# EAGLE design W051X (EAGLE 6.6.0)
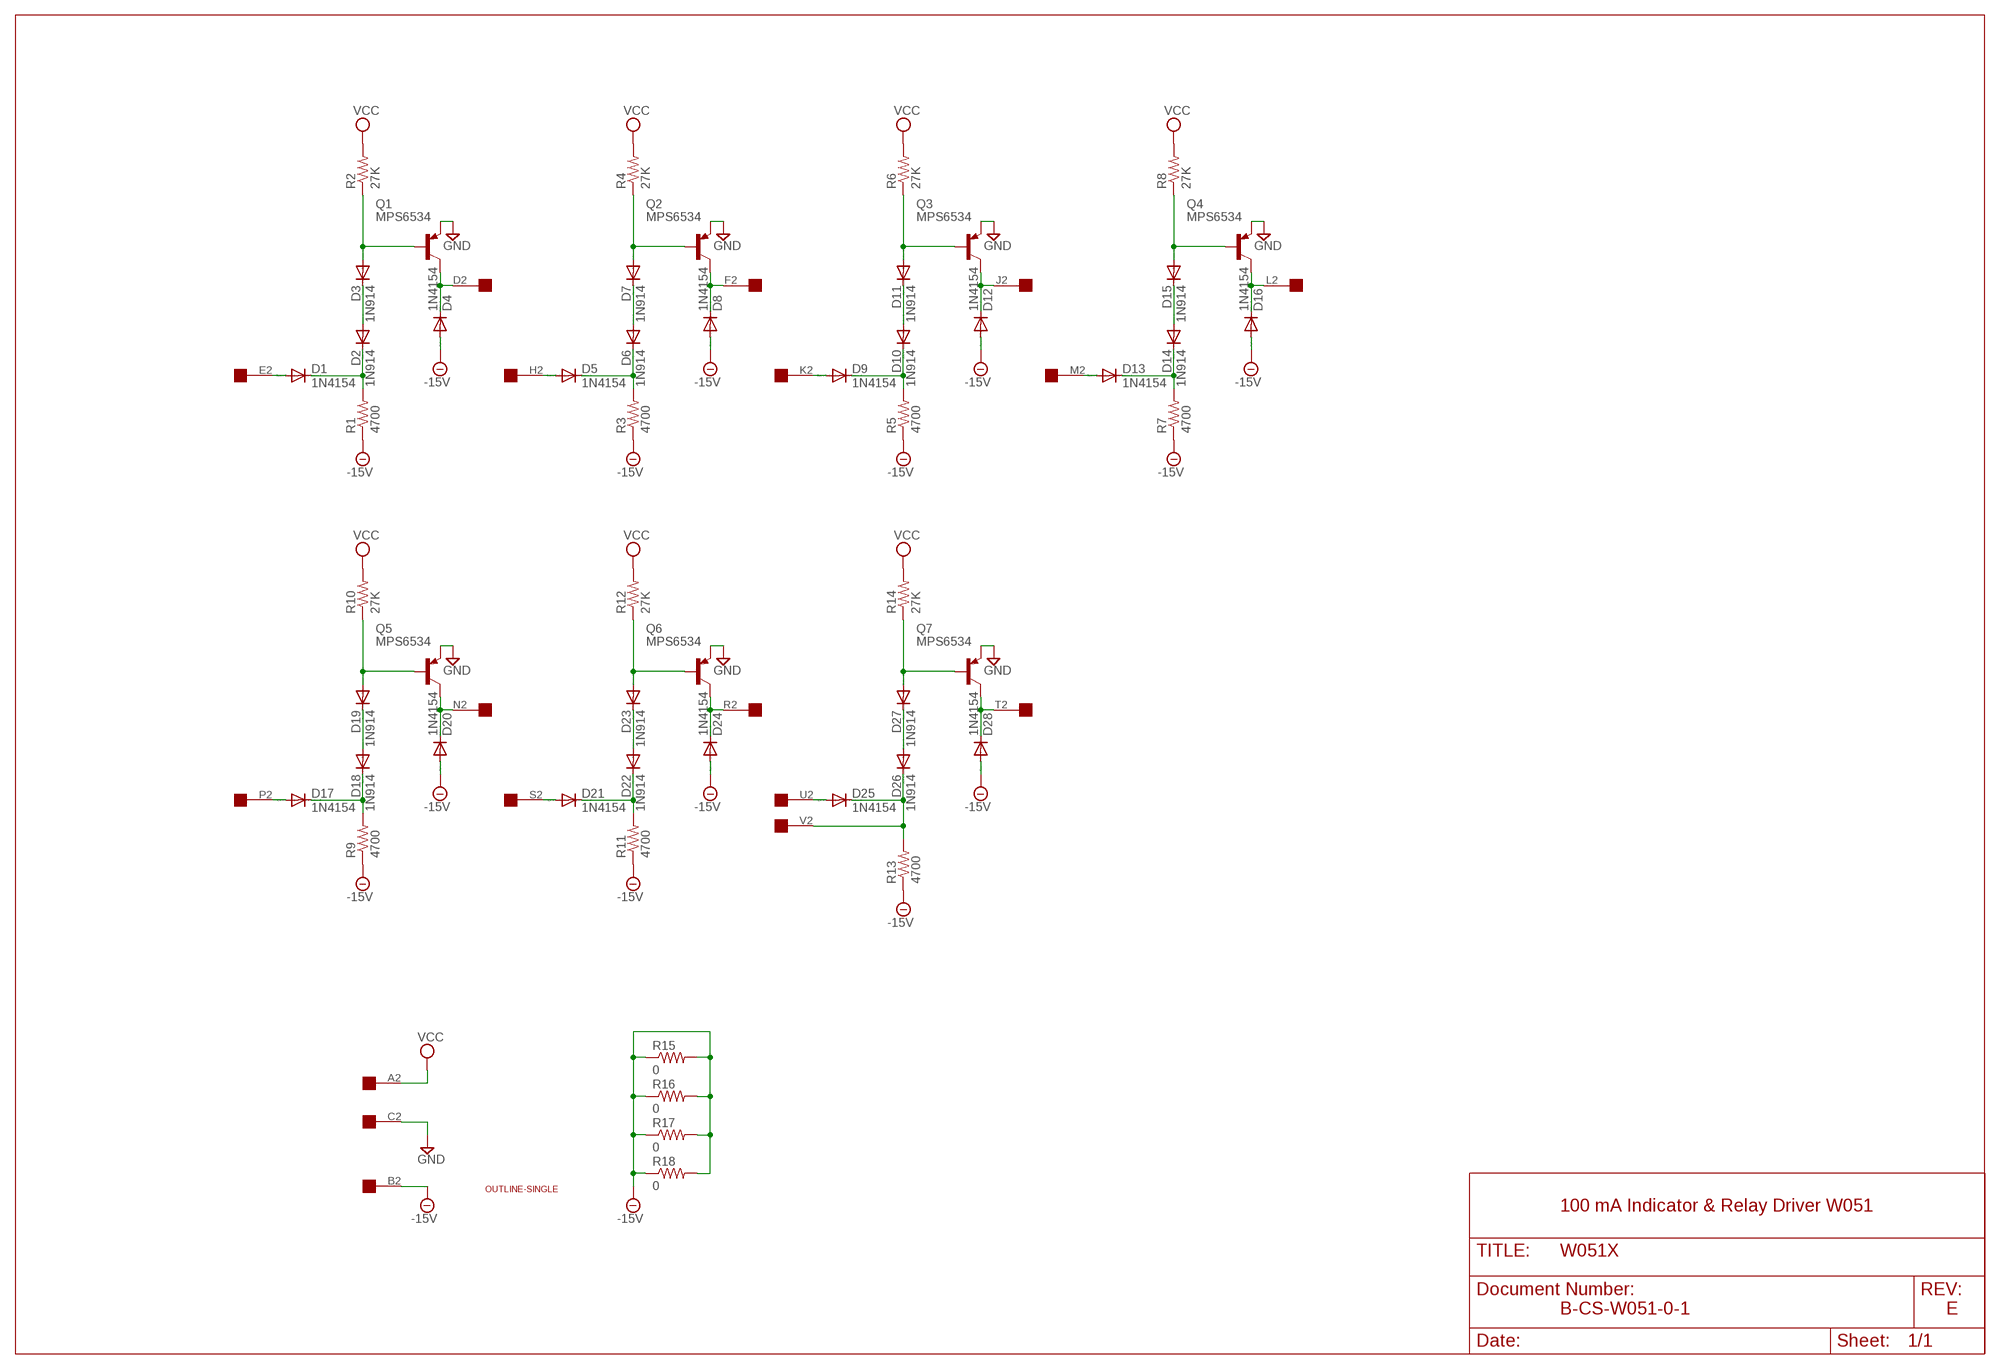
[diagram p0: schematic, sheet 1]

## Parts
D1  1N4154  DIODE-DO35-10  [DO35-10]
D2  1N914  DIODE-DO35-10  [DO35-10]
D3  1N914  DIODE-DO35-10  [DO35-10]
D4  1N4154  DIODE-DO35-10  [DO35-10]
D5  1N4154  DIODE-DO35-10  [DO35-10]
D6  1N914  DIODE-DO35-10  [DO35-10]
D7  1N914  DIODE-DO35-10  [DO35-10]
D8  1N4154  DIODE-DO35-10  [DO35-10]
D9  1N4154  DIODE-DO35-10  [DO35-10]
D10  1N914  DIODE-DO35-10  [DO35-10]
D11  1N914  DIODE-DO35-10  [DO35-10]
D12  1N4154  DIODE-DO35-10  [DO35-10]
D13  1N4154  DIODE-DO35-10  [DO35-10]
D14  1N914  DIODE-DO35-10  [DO35-10]
D15  1N914  DIODE-DO35-10  [DO35-10]
D16  1N4154  DIODE-DO35-10  [DO35-10]
D17  1N4154  DIODE-DO35-10  [DO35-10]
D18  1N914  DIODE-DO35-10  [DO35-10]
D19  1N914  DIODE-DO35-10  [DO35-10]
D20  1N4154  DIODE-DO35-10  [DO35-10]
D21  1N4154  DIODE-DO35-10  [DO35-10]
D22  1N914  DIODE-DO35-10  [DO35-10]
D23  1N914  DIODE-DO35-10  [DO35-10]
D24  1N4154  DIODE-DO35-10  [DO35-10]
D25  1N4154  DIODE-DO35-10  [DO35-10]
D26  1N914  DIODE-DO35-10  [DO35-10]
D27  1N914  DIODE-DO35-10  [DO35-10]
D28  1N4154  DIODE-DO35-10  [DO35-10]
Q1  MPS6534  -PNP-TO5  [TO5]
Q2  MPS6534  -PNP-TO5  [TO5]
Q3  MPS6534  -PNP-TO5  [TO5]
Q4  MPS6534  -PNP-TO5  [TO5]
Q5  MPS6534  -PNP-TO5  [TO5]
Q6  MPS6534  -PNP-TO5  [TO5]
Q7  MPS6534  -PNP-TO5  [TO5]
R1  4700  R-US_0207/10  [0207/10]
R2  27K  R-US_0207/10  [0207/10]
R3  4700  R-US_0207/10  [0207/10]
R4  27K  R-US_0207/10  [0207/10]
R5  4700  R-US_0207/10  [0207/10]
R6  27K  R-US_0207/10  [0207/10]
R7  4700  R-US_0207/10  [0207/10]
R8  27K  R-US_0207/10  [0207/10]
R9  4700  R-US_0207/10  [0207/10]
R10  27K  R-US_0207/10  [0207/10]
R11  4700  R-US_0207/10  [0207/10]
R12  27K  R-US_0207/10  [0207/10]
R13  4700  R-US_0207/10  [0207/10]
R14  27K  R-US_0207/10  [0207/10]
R15  0  R-US_0207/10  [0207/10]
R16  0  R-US_0207/10  [0207/10]
R17  0  R-US_0207/10  [0207/10]
R18  0  R-US_0207/10  [0207/10]
U$1  OUTLINE-SINGLE  [SINGLE]
U$2  EDGE-1  [EDGE-CON1]

## Nets
-15V: D4.A D8.A D12.A D16.A D20.A D24.A D28.A R1.1 R3.1 R5.1 R7.1 R9.1 R11.1 R13.1 R15.1 R15.2 R16.1 R16.2 R17.1 R17.2 R18.1 R18.2 U$2.B2
GND: Q1.1(E) Q2.1(E) Q3.1(E) Q4.1(E) Q5.1(E) Q6.1(E) Q7.1(E) U$2.C2
N$1: D1.C D2.C R1.2
N$2: D2.A D3.C
N$3: D3.A Q1.2(B) R2.1
N$4: D4.C Q1.3(C) U$2.D2
N$5: D1.A U$2.E2
N$6: D5.C D6.C R3.2
N$7: D6.A D7.C
N$8: D7.A Q2.2(B) R4.1
N$9: D8.C Q2.3(C) U$2.F2
N$10: D5.A U$2.H2
N$11: D9.C D10.C R5.2
N$12: D10.A D11.C
N$13: D11.A Q3.2(B) R6.1
N$14: D12.C Q3.3(C) U$2.J2
N$15: D9.A U$2.K2
N$16: D13.C D14.C R7.2
N$17: D14.A D15.C
N$18: D15.A Q4.2(B) R8.1
N$19: D16.C Q4.3(C) U$2.L2
N$20: D13.A U$2.M2
N$21: D17.C D18.C R9.2
N$22: D18.A D19.C
N$23: D19.A Q5.2(B) R10.1
N$24: D28.C Q7.3(C) U$2.T2
N$25: D17.A U$2.P2
N$26: D21.C D22.C R11.2
N$27: D22.A D23.C
N$28: D23.A Q6.2(B) R12.1
N$29: D24.C Q6.3(C) U$2.R2
N$30: D21.A U$2.S2
N$31: D25.C D26.C R13.2 U$2.V2
N$32: D26.A D27.C
N$33: D27.A Q7.2(B) R14.1
N$34: D20.C Q5.3(C) U$2.N2
N$35: D25.A U$2.U2
VCC: R2.2 R4.2 R6.2 R8.2 R10.2 R12.2 R14.2 U$2.A2

## Notes on the sheet
- 100 mA Indicator & Relay Driver W051
- B-CS-W051-0-1 | E

## Library data of the parts
D1-D28 = diode:DIODE-: DIODE
Q1-Q7 = transistor:*-PNP-: PNP Transistror
R1-R18 = rcl:R-US_: RESISTOR, American symbol
U$1 = dec-con:OUTLINE-*: Board outlines for DEC boards.
U$2 = dec-con:EDGE-1: Single-Sided DEC Edge Connector -- (side 2)

## Net classes
0 default: width 0.813 mm

## Board
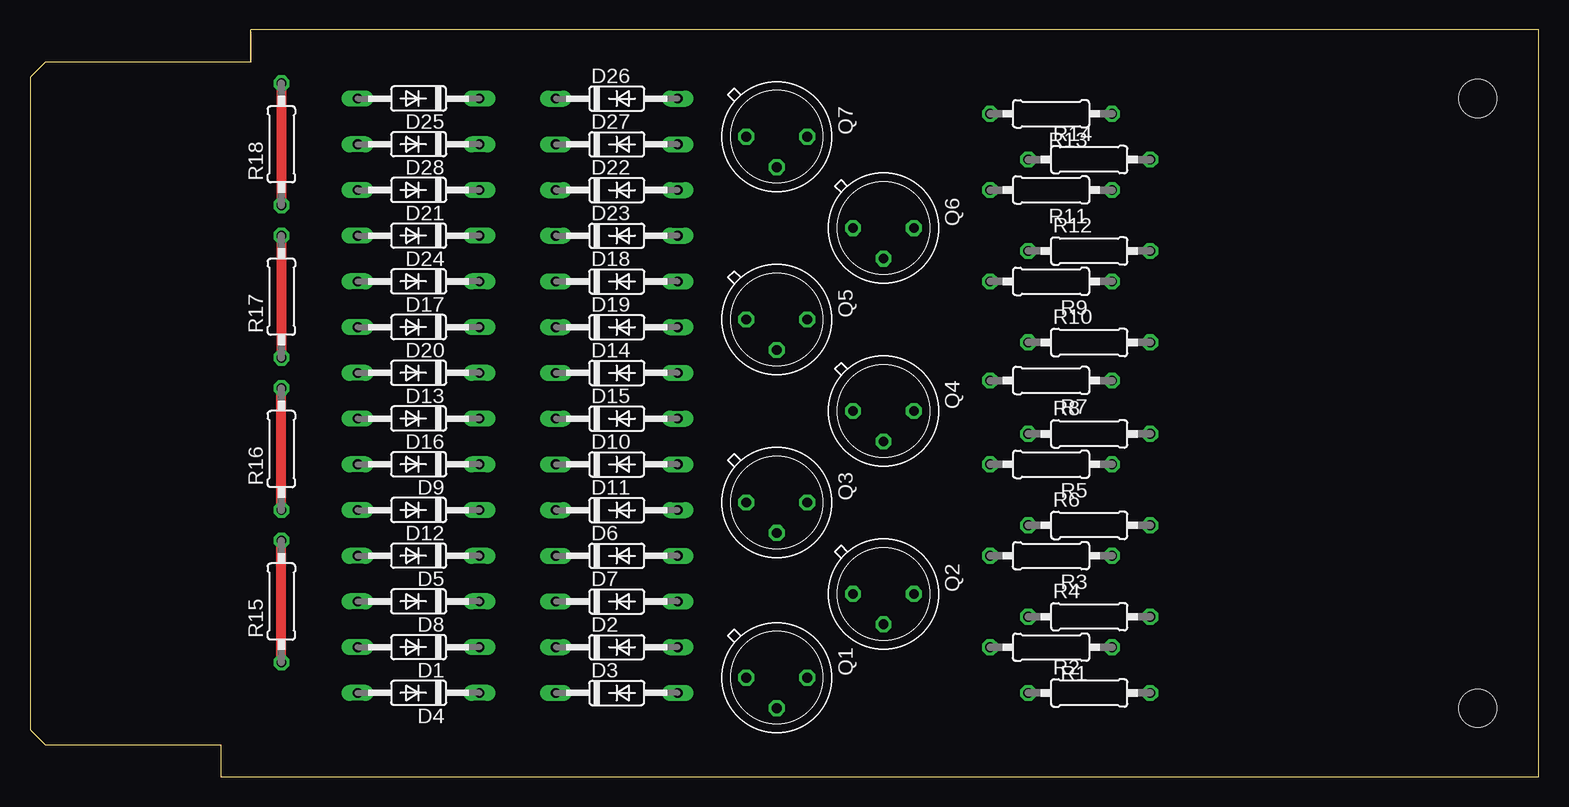
[diagram p1: board, top side]
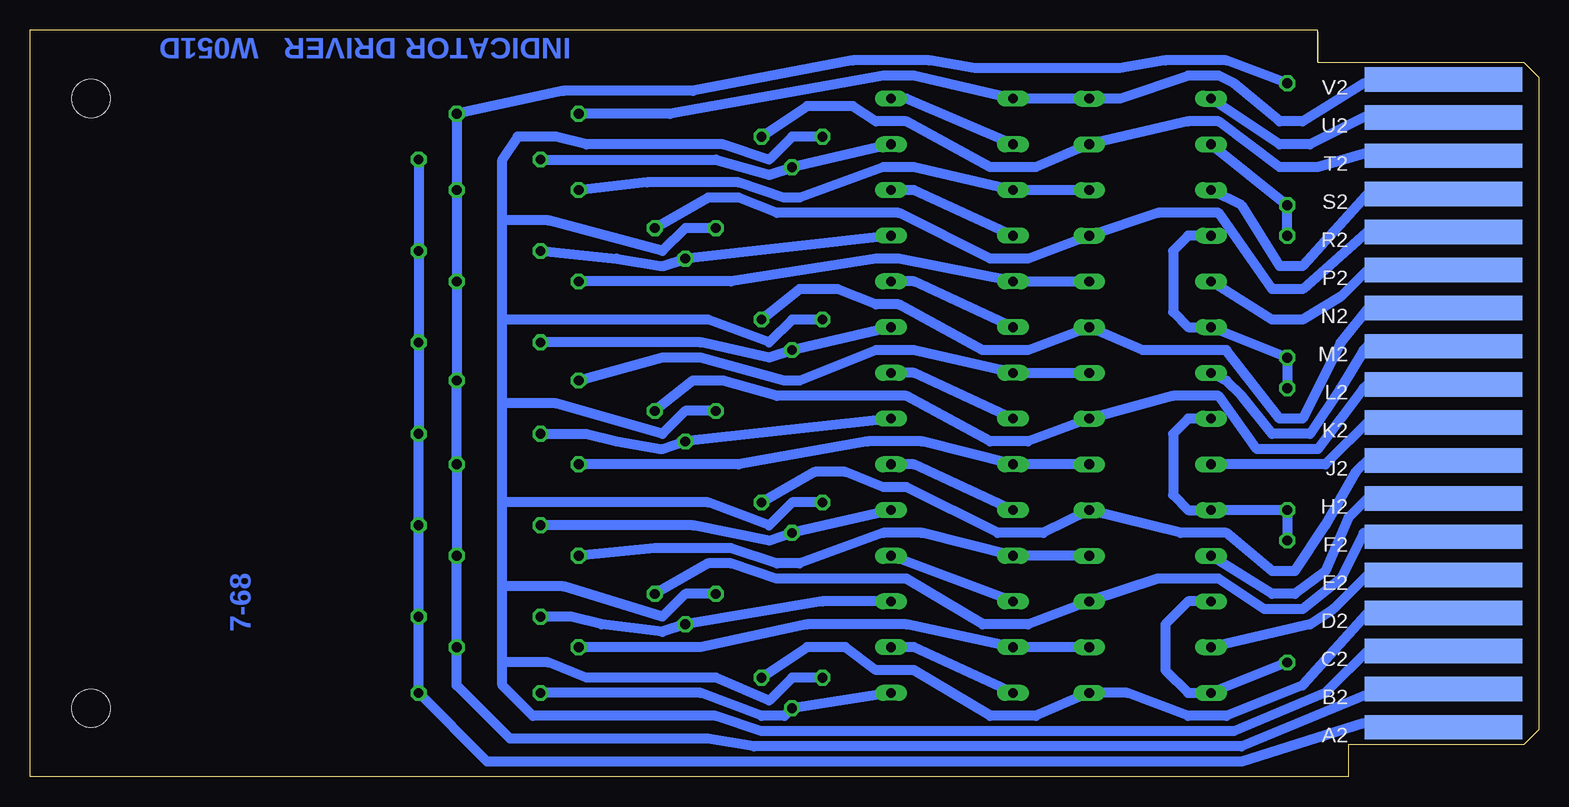
[diagram p2: board, bottom side, seen from below]

Size 125.73 x 62.23 mm. Coordinates in mm from the lower left corner, seen from the top.
Copper layers (1+16): Top 0.035mm / dielectric 1.5mm / Bottom 0.035mm
Design rules "16mils": minimum track width 16mil, minimum drill 32mil, track to track 15mil, track to pad 10mil, pad to pad 10mil, via to via 10mil, smd to smd 10mil, copper to edge 13mil, drill to drill 10mil, minimum pad ring 10mil, minimum via ring 8mil, stop-mask expansion 0mil, vias tented up to drill 0mil, thermal gap 10mil

### Footprints (pad centres in the part's own frame; a part is rotated, then mirrored left to right if it is on the bottom)
DO35-10 = drill 0.813 long: A 5.08,0; C -5.08,0
TO5 = drill 0.813 octagon: 1 0,-2.54; 2 2.54,0; 3 0,2.54
0207/10 = drill 0.813 octagon: 1 -5.08,0; 2 5.08,0
SINGLE = hole 3.175: 120.65,56.515; 120.65,5.715
EDGE-CON1 = smd 13.106 x 2.032 bottom: A2 7.938,4.128; B2 7.938,7.303; C2 7.938,10.477; D2 7.938,13.652; E2 7.938,16.828; F2 7.938,20.003; H2 7.938,23.177; J2 7.938,26.352; K2 7.938,29.527; L2 7.938,32.703; M2 7.938,35.877; N2 7.938,39.053; P2 7.938,42.227; R2 7.938,45.403; S2 7.938,48.578; T2 7.938,51.752; U2 7.938,54.928; V2 7.938,58.102

### Placement (x,y rotation side)
D1  32.39,10.79 180 top
D2  48.9,10.79 0 top
D3  48.9,6.99 0 top
D4  32.39,6.99 180 top
D5  32.39,18.41 180 top
D6  48.9,18.41 0 top
D7  48.9,14.61 0 top
D8  32.39,14.61 180 top
D9  32.39,26.04 180 top
D10  48.9,26.04 0 top
D11  48.9,22.23 0 top
D12  32.39,22.23 180 top
D13  32.39,33.66 180 top
D14  48.9,33.66 0 top
D15  48.9,29.84 0 top
D16  32.39,29.84 180 top
D17  32.39,41.27 180 top
D18  48.9,41.27 0 top
D19  48.9,37.47 0 top
D20  32.39,37.47 180 top
D21  32.39,48.9 180 top
D22  48.9,48.9 0 top
D23  48.9,45.09 0 top
D24  32.39,45.09 180 top
D25  32.39,56.52 180 top
D26  48.9,56.52 0 top
D27  48.9,52.7 0 top
D28  32.39,52.7 180 top
Q1  62.23,8.26 270 top
Q2  71.12,15.24 270 top
Q3  62.23,22.86 270 top
Q4  71.12,30.48 270 top
Q5  62.23,38.1 270 top
Q6  71.12,45.72 270 top
Q7  62.23,53.34 270 top
R1  85.09,10.79 180 top
R2  88.27,6.99 0 top
R3  85.09,18.41 180 top
R4  88.27,13.34 0 top
R5  85.09,26.04 180 top
R6  88.27,20.95 0 top
R7  85.09,33.02 180 top
R8  88.27,28.57 0 top
R9  85.09,41.27 180 top
R10  88.27,36.2 0 top
R11  85.09,48.9 180 top
R12  88.27,43.81 0 top
R13  85.09,55.24 180 top
R14  88.27,51.44 0 top
R15  20.96,14.61 90 top
R16  20.96,27.3 90 top
R17  20.96,40.01 90 top
R18  20.96,52.7 90 top
U$1  0,0 0 top
U$2  0,0 0 top

### Tracks (layer width: path | path; a pad name or v marks a point on that pad's centre or on a via)
-15V
  Top 0.813: R15.1 R15.2 | R16.1 R16.2 | R17.2 R17.1 | R18.2 R18.1
  Bottom 0.813: U$2.B2 7.62,6.99 13.97,6.99 24.77,2.54 65.41,2.54 69.22,3.17 85.73,3.17 90.17,7.62 R1.1 R3.1 R5.1 R7.1 R9.1 R11.1 R13.1 81.28,57.15 70.49,57.15 57.15,59.69 50.8,59.69 46.99,59.05 34.93,59.05 31.12,59.69 26.04,59.69 R18.2 | D28.A R18.1 R17.2 | R16.2 R17.1 D20.A 29.21,37.47 30.48,38.73 30.48,43.81 29.21,45.09 D24.A | R15.2 R16.1 D12.A 29.21,22.23 30.48,23.5 30.48,28.57 29.21,29.84 D16.A | R15.1 D4.A 29.21,6.99 31.12,8.89 31.12,12.7 29.21,14.61 D8.A
GND
  Bottom 0.813: U$2.C2 8.26,10.79 13.97,10.79 17.78,6.99 25.4,3.81 64.77,3.81 68.58,5.08 83.82,5.08 86.36,7.62 86.36,9.53 | 86.36,9.53 86.36,15.88 | 86.36,15.88 86.36,22.86 | 86.36,22.86 86.36,31.11 | 86.36,31.11 86.36,38.1 | 86.36,38.1 86.36,46.35 | 86.36,46.35 86.36,51.44 85.09,53.34 81.92,53.34 79.38,52.7 67.95,52.7 64.14,51.44 62.23,53.34 Q7.1 | Q1.1 62.23,8.26 64.14,6.35 68.58,8.26 79.38,8.26 82.55,9.53 86.36,9.53 | Q3.1 62.23,22.86 64.14,20.95 69.22,22.86 86.36,22.86 | Q5.1 62.23,38.1 64.14,36.2 69.22,38.1 86.36,38.1 | Q4.1 71.12,30.48 73.03,28.57 81.92,31.11 86.36,31.11 | Q2.1 71.12,15.24 73.03,13.34 81.28,15.88 86.36,15.88 | Q6.1 71.12,45.72 73.03,43.81 82.55,46.35 86.36,46.35
N$1
  Bottom 0.813: D1.C D2.C 52.71,12.7 60.96,12.7 69.85,10.79 R1.2
N$2
  Bottom 0.813: D3.C 52.07,10.79 D2.A
N$3
  Bottom 0.813: D3.A Q1.2 62.87,5.08 64.77,5.08 69.85,6.99 R2.1
N$4
  Bottom 0.813: U$2.D2 9.53,13.97 13.97,13.97 19.69,7.62 26.04,5.08 29.21,5.08 34.29,6.99 D4.C 41.91,5.08 45.72,5.08 52.07,8.89 55.25,8.89 57.79,10.79 60.96,10.79 Q1.3
N$5
  Bottom 0.813: U$2.E2 8.89,17.14 13.97,17.14 17.15,13.97 19.05,12.7 D1.A
N$6
  Bottom 0.813: D5.C D6.C 51.44,20.32 54.61,20.32 61.6,17.78 63.5,17.78 67.31,19.05 73.66,19.05 R3.2
N$7
  Bottom 0.813: D7.C D6.A
N$8
  Bottom 0.813: D7.A 59.69,14.61 Q2.2 73.03,12.06 78.11,12.7 80.65,13.34 R4.1
N$9
  Bottom 0.813: U$2.F2 7.62,20.32 14.61,20.32 16.51,16.51 19.69,13.97 22.86,13.97 26.67,16.51 31.75,16.51 D8.C 42.55,12.7 46.36,12.7 52.71,16.51 63.5,16.51 67.31,17.78 69.22,17.78 Q2.3
N$10
  Bottom 0.813: U$2.H2 8.89,23.5 13.97,23.5 15.88,21.59 17.78,17.14 20.32,15.24 22.23,15.24 D5.A
N$11
  Bottom 0.813: D9.C D10.C 51.44,27.94 55.88,27.94 66.68,26.04 R5.2
N$12
  Bottom 0.813: D11.C 52.07,26.04 D10.A
N$13
  Bottom 0.813: D11.A Q3.2 64.14,19.68 70.49,20.95 R6.1
N$14
  Bottom 0.813: U$2.J2 8.89,26.67 13.97,26.67 15.24,25.4 17.78,20.95 20.32,17.14 22.23,17.14 26.04,20.32 29.85,20.32 D12.C 41.28,20.32 45.09,20.32 52.71,24.13 54.61,24.13 57.79,25.4 60.33,25.4 Q3.3
N$15
  Bottom 0.813: U$2.K2 8.89,29.84 13.97,29.84 17.78,26.04 D9.A
N$16
  Bottom 0.813: D13.C D14.C 52.07,35.56 55.25,35.56 61.6,33.02 62.87,33.02 69.85,34.92 73.03,34.92 R7.2
N$17
  Bottom 0.813: D15.C 52.07,33.66 D14.A
N$18
  Bottom 0.813: D15.A Q4.2 73.03,27.3 76.84,27.94 79.38,28.57 R8.1
N$19
  Bottom 0.813: U$2.L2 8.89,33.02 13.97,33.02 14.61,32.38 18.42,27.3 23.5,27.3 26.67,31.75 30.48,31.75 D16.C 42.55,27.94 45.72,27.94 52.71,31.75 63.5,31.75 67.95,33.02 70.49,33.02 Q4.3
N$20
  Bottom 0.813: U$2.M2 10.16,36.2 13.97,36.2 14.61,35.56 16.51,32.38 19.05,28.57 22.23,28.57 24.77,31.75 26.04,33.02 D13.A
N$21
  Bottom 0.813: D17.C D18.C 53.34,43.18 55.25,43.18 67.31,41.27 R9.2
N$22
  Bottom 0.813: D19.C 52.07,41.27 D18.A
N$23
  Bottom 0.813: D19.A Q5.2 64.14,34.92 69.85,36.2 R10.1
N$24
  Bottom 0.813: U$2.T2 8.26,52.07 13.97,52.07 18.42,50.8 21.59,50.8 26.67,54.61 29.21,54.61 D28.C 41.91,50.8 45.72,50.8 52.71,54.61 55.25,54.61 57.15,55.88 60.96,55.88 Q7.3
N$25
  Bottom 0.813: U$2.P2 9.53,42.55 13.97,42.55 16.51,40.01 19.69,38.1 22.23,38.1 D17.A
N$26
  Bottom 0.813: D21.C D22.C 52.07,50.8 54.61,50.8 61.6,48.26 62.87,48.26 66.68,49.53 74.3,49.53 R11.2
N$27
  Bottom 0.813: D23.C 52.07,48.9 D22.A
N$28
  Bottom 0.813: D23.A Q6.2 73.03,42.55 76.84,43.18 R12.1
N$29
  Bottom 0.813: U$2.R2 8.89,45.72 13.97,45.72 19.69,40.64 22.23,40.64 26.67,46.99 31.75,46.99 D24.C 42.55,43.18 45.72,43.18 53.34,46.99 63.5,46.99 66.68,48.26 69.22,48.26 Q6.3
N$30
  Bottom 0.813: U$2.S2 8.89,48.9 13.97,48.9 19.69,42.55 21.59,42.55 24.77,47.62 D21.A
N$31
  Bottom 0.813: U$2.V2 8.26,57.78 14.61,57.78 19.69,54.61 21.59,54.61 25.4,57.78 26.67,58.42 29.21,58.42 34.93,56.52 D25.C D26.C 52.07,58.42 54.61,58.42 72.39,55.24 R13.2
N$32
  Bottom 0.813: D27.C 52.71,56.52 D26.A
N$33
  Bottom 0.813: D27.A Q7.2 64.14,50.16 68.58,51.44 R14.1
N$34
  Bottom 0.813: U$2.N2 8.89,39.37 13.97,39.37 16.51,36.2 19.69,29.84 21.59,29.84 26.04,35.56 33.02,35.56 D20.C 42.55,35.56 46.36,35.56 53.34,39.37 55.25,39.37 58.42,40.64 61.6,40.64 Q5.3
N$35
  Bottom 0.813: U$2.U2 8.26,55.24 13.97,55.24 19.05,52.7 21.59,52.7 D25.A
VCC
  Bottom 0.813: R14.2 R12.2 R10.2 R8.2 R6.2 R4.2 R2.2 87.63,1.27 24.77,1.27 14.61,4.45 8.26,4.45 8.26,4.13 U$2.A2

### Text on the board
Bottom: INDICATOR DRIVER | W051D | 7-68